# Altium schematic sheet 示波器原理图5.SchDoc
size A4
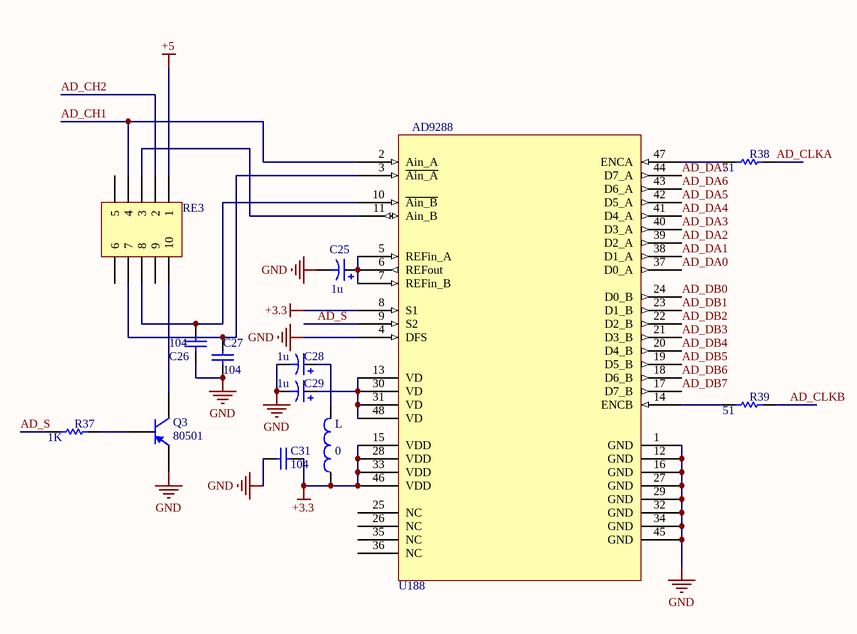
[diagram p0: 示波器原理图5.SchDoc]

## Parts
C25  value 1u  [C0805]
C26  value 104  [PCBComponent_1]
C27  value 104  [PCBComponent_1]
C28  value 1u  [C0805]
C29  value 1u  [C0805]
C31  value 104  [PCBComponent_1]
L  value 0  [L0603]
Q3  80501  [PCBComponent_1]
R37  1K  [2012[0805]]
R38  51  [2012[0805]]
R39  51  [2012[0805]]
RE3  (no value)  [PCBComponent_1]
U188  (no value)  [TSQFP50P900X900X160-48N]

## Nets
+3.3: C31.1 L.1 U188.8(S1) U188.15(VDD) U188.28(VDD) U188.33(VDD) U188.46(VDD)
+5: RE3.1
GND: C25.2 C26.2 C27.2 C28.2 C29.2 C31.2 Q3.1(E) U188.1(GND) U188.4(DFS) U188.12(GND) U188.16(GND) U188.27(GND) U188.29(GND) U188.32(GND) U188.34(GND) U188.45(GND)
AD_CH1: RE3.4 U188.2(Ain_A)
AD_CH2: RE3.2
AD_CLKA: R38.2
AD_CLKB: R39.2
AD_DA0: U188.37(D0_A)
AD_DA1: U188.38(D1_A)
AD_DA2: U188.39(D2_A)
AD_DA3: U188.40(D3_A)
AD_DA4: U188.41(D4_A)
AD_DA5: U188.42(D5_A)
AD_DA6: U188.43(D6_A)
AD_DA7: U188.44(D7_A)
AD_DB0: U188.24(D0_B)
AD_DB1: U188.23(D1_B)
AD_DB2: U188.22(D2_B)
AD_DB3: U188.21(D3_B)
AD_DB4: U188.20(D4_B)
AD_DB5: U188.19(D5_B)
AD_DB6: U188.18(D6_B)
AD_DB7: U188.17(D7_B)
AD_S: R37.1 U188.9(S2)
NetC25_1: C25.1 U188.5(REFin_A) U188.6(REFout) U188.7(REFin_B)
NetC26_1: C26.1 RE3.8 U188.10(~{Ain_B})
NetC27_1: C27.1 RE3.7 U188.3(~{Ain_A})
NetC28_1: C28.1 L.2
NetC29_1: C29.1 U188.13(VD) U188.30(VD) U188.31(VD) U188.48(VD)
NetQ3_2: Q3.2(B) R37.2
NetQ3_3: Q3.3(C) RE3.10
NetR38_1: R38.1 U188.47(ENCA)
NetR39_1: R39.1 U188.14(ENCB)
NetRE3_3: RE3.3 U188.11(Ain_B)

Not connected (* = marked no-connect by the designer): RE3 5 6 9; U188 25(NC) 26(NC) 35(NC) 36(NC)

## Notes on the sheet
- (in symbol Component_1) AD9288

## Library data of the parts
C25 C28 C29 = Cap Pol3: Polarized Capacitor (Surface Mount); Published: 8-Jun-2000; LatestRevisionDate: 17-Jul-2002; LatestRevisionNote: Re-released for DXP Platform.; PackageReference: C0805; Publisher: Altium Limited
C26 C27 C31 = Cap: Capacitor; Published: 8-Jun-2000; LatestRevisionDate: 17-Jul-2002; LatestRevisionNote: Re-released for DXP Platform.; PackageReference: RAD-0.3; Publisher: Altium Limited
L = Inductor: Code_IEC: 1005; Published: 8-Jun-2000; LatestRevisionDate: 17-Jul-2002; LatestRevisionNote: Re-released for DXP Platform.; PackageReference: 0402-A; Publisher: Altium Limited; Code_JEITA: 0402
Q3 = 2N3906: PNP General Purpose Amplifier; Published: 8-Jun-2000; LatestRevisionDate: 15-Jan-2003; LatestRevisionNote: PCB Footprint 'BCY-W3/D4.7' replaced; DatasheetDocument: 1997; PackageDocument: Sep-1998; PackageReference: TO-92A; Publisher: Altium Limited; Code_JEDEC: TO-92A; ComponentLink1Description: Manufacturer Link; ComponentLink1URL: http://www.fairchildsemi.com/; ComponentLink2Description: Datasheet; ComponentLink2URL: http://www.fairchildsemi.com/ds/2N%2F2N3906.pdf
R37-R39 = Res Semi: Semiconductor Resistor; Published: 8-Jun-2000; LatestRevisionDate: 17-Jul-2002; LatestRevisionNote: Re-released for DXP Platform.; PackageReference: AXIAL-0.5; Publisher: Altium Limited
RE3 U188 = Component_1